# Altium schematic sheet ard_connector.SchDoc
size A
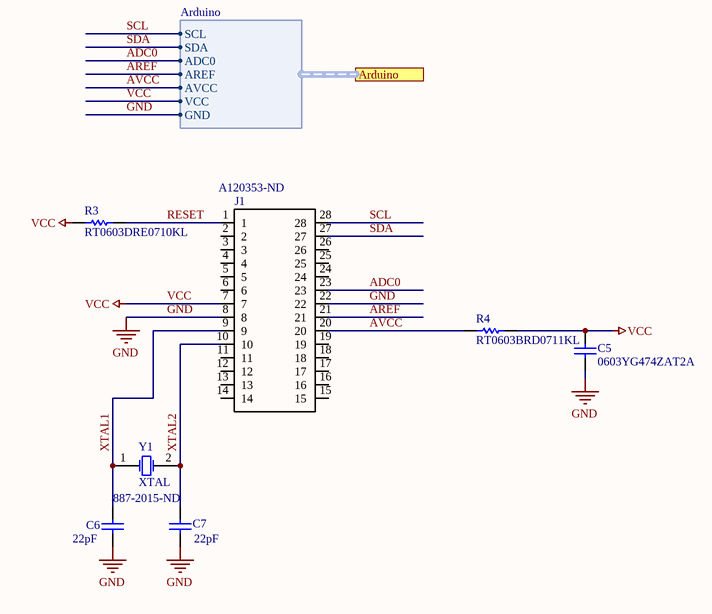
[diagram p0: ard_connector.SchDoc]

## Parts
C5  0603YG474ZAT2A  [CAPC1608X90X35ML15T15]
C6  Capacitance: 22pF  [CAPC1608X90X30LL10T20]  (hidden comment: CL10C220JB8NNNC)
C7  Capacitance: 22pF  [CAPC1608X90X30LL10T20]  (hidden comment: CL10C220JB8NNNC)
J1  Supplier Part Number 1: A120353-ND  [*DIP762W60P254L3556H510Q28]  (hidden comment: 1-2199298-9)
R3  RT0603DRE0710KL  [RESC1608X55X25ML10T15]
R4  RT0603BRD0711KL  [RESC1608X55X25LL10T15]
Y1  XTAL  Supplier Part Number 1: 887-2015-ND  [R38]

## Ports
Arduino (harness Arduino)

## Harnesses
Arduino: SCL, SDA, ADC0, AREF, AVCC, VCC, GND

## Nets
GND: C5.1 C6.1 C7.1 J1.8 J1.22 ; port Arduino.GND
VCC: C5.2 J1.7 R3.1 R4.2 ; port Arduino.VCC
ADC0: J1.23 ; port Arduino.ADC0
AREF: J1.21 ; port Arduino.AREF
AVCC: J1.20 R4.1 ; port Arduino.AVCC
RESET: J1.1 R3.2
SCL: J1.28 ; port Arduino.SCL
SDA: J1.27 ; port Arduino.SDA
XTAL1: C6.2 J1.9 Y1.1(OSC1)
XTAL2: C7.2 J1.10 Y1.2(OSC2)

Not connected (* = marked no-connect by the designer): J1 2 3 4 5 6 11 12 13 14 15 16 17 18 19 24 25 26

## Library data of the parts
C5 = CMP-2006-04546-1: Manufacturer: AVX Interconnect / Elco; Part Number: 0603YG474ZAT2A
C6 C7 = CMP-2000-06101-1: Chip Capacitor, 22 pF, +/- 5%, 50 V, -55 to 125 degC, 0603 (1608 Metric), RoHS, Tape and Reel; Manufacturer: Samsung Electro-Mechanics; Rated Voltage: 50V; Dielectric: C0G; Case Size/Dimension: 0603; Mounting Technology: SurfaceMount; Tolerance (%): ±5%; Package Description: 2-Pin Surface Mount Device, Body 1.60 x 0.80 mm; Manufacturer URL: http://www.samsungsem.com/global/index.jsp; Datasheet URL: http://www.samsungsem.com/kr/support/product-search/mlcc/__icsFiles/afieldfile/2016/08/18/S_CL10C220JB8NNNC.pdf; Datasheet Version: 06/2016; Package Reference: 0603
J1 = 1-2199298-9: CONN IC DIP SOCKET 28POS TIN; Number_of_Positions: 28; MF: TE Connectivity; Centerline_Pitch: 2.54 mm[.1 in]; Connector Type: Pin; Current Rating: 1A; Insulation Resistance: 1GR; Mating Alignment: Yes (With); Row Spacing: 0.3inch; Pitch: 2.54mm; Contact Post Length: 3inch; TE_purchase_URL: https://www.te.com/usa-en/product-1-2199298-9.html?te_bu=Cor&te_type=disp&te_campaign=seda_glo_cor-seda-global-disp-prtnr-fy19-seda-model-bom-cta_sma-317_1&elqCampaignId=32493; Product_Type: Socket; EU_RoHS_Compliance: Compliant; SnapEDA_Link: https://www.snapeda.com/parts/1-2199298-9/TE%20Connectivity%20AMP%20Connectors/view-part/1265789/?ref=snap; MP: 1-2199298-9; Digi-Key_Purchase_URL: https://www.digikey.com/product-detail/en/te-connectivity-amp-connectors/1-2199298-9/A120353-ND/5022045?utm_source=snapeda&utm_medium=aggregator&utm_campaign=symbol; Digi-Key_Part_Number: A120353-ND; Package: PDIP-28 TE Connectivity; Value: *; Supplier 1: Digi-Key; Manufacturer: TE Connectivity; Manufacturer Part Number: 1-2199298-9; RoHS: Yes; Category: IC and Component Sockets; Stock 1: 4877; Pricing 1: 1=0.73000, 10=0.68600, 25=0.61760, 50=0.54920, 100=0.52630, 250=0.48052, 500=0.45762, 1000=0.37754, 2500=0.34322 (USD); Mount: Through Hole; Contact Material: Bronze; Contact Plating: Tin; Color: Black; Insulation Material: Thermoplastic; Housing Material: PBT; Min Operating Temperature: -40°C; Max Operating Temperature: 105°C; Number of Rows: 2; Number of Contacts: 28; Termination: Through Hole; Number of Poles: 28; Orientation: Straight; Packaging: Rail/Tube; Number of Positions: 28; Package Quantity: 17; Contact Current Rating: 1A; Length: 1.4inch; Radiation Hardening: No; REACH SVHC: Unknown; ELV: Compliant; Flammability Rating: UL94 V-0; ComponentLink1URL: https://www.distrelec.biz/Web/Downloads/_t/ds/1-2199298-9_eng_tds.pdf?mime=application%2Fpdf&src-supplier=Distrelec; ComponentLink1Description: https://www.distrelec.biz/Web/Downloads/_t/ds/1-2199298-9_eng_tds.pdf?mime=application%2Fpdf&src-supplier=Distrelec; ComponentLink2URL: http://www.te.com/commerce/DocumentDelivery/DDEController?Action=showdoc&DocId=Customer+Drawing%7F2199298%7FA%7Fpdf%7FEnglish%7FENG_CD_2199298_A_baseFilename.pdf&src-supplier=Avnet; ComponentLink2Description: http://www.te.com/commerce/DocumentDelivery/DDEController?Action=showdoc&DocId=Customer+Drawing%7F2199298%7FA%7Fpdf%7FEnglish%7FENG_CD_2199298_A_baseFilename.pdf&src-supplier=Avnet; ComponentLink3URL: https://www.te.com/commerce/DocumentDelivery/DDEController?Action=srchrtrv&DocNm=2199298&DocType=Customer+Drawing&DocLang=English&src-supplier=Digi-Key; ComponentLink3Description: https://www.te.com/commerce/DocumentDelivery/DDEController?Action=srchrtrv&DocNm=2199298&DocType=Customer+Drawing&DocLang=English&src-supplier=Digi-Key
R3 = CMP-2000-04608-1: Manufacturer: Yageo; Part Number: RT0603DRE0710KL
R4 = CMP-2000-04350-1: Manufacturer: Yageo; Part Number: RT0603BRD0711KL
Y1 = XTAL: CRYSTAL 16.000MHZ 20PF THRU; Manufacturer: TXC; Manufacturer Part Number: 9B-16.000MBBK-B; Frequency: 16MHz; Frequency Tolerance: 50ppm; ESR (Equivalent Series Resistance): 30R; Published: 8-Jun-2000; LatestRevisionDate: 17-Jul-2002; LatestRevisionNote: Re-released for DXP Platform.; PackageReference: R38; Publisher: Altium Limited; PackageDescription: Crystal, Thru-Hole; 2 Leads; Body 3.1 x 8.2 mm (Dia.xH); Supplier 1: Digi-Key; RoHS: Yes; Category: Crystals; Stock 1: 2492; Pricing 1: 1=0.30000, 10=0.25000, 50=0.22500, 100=0.20000, 500=0.19000, 1000=0.16000, 2500=0.15000, 5000=0.14500, 10000=0.14000 (USD); Mount: Through Hole; Case/Package: Metal; Number of Pins: 2; Min Operating Temperature: -20°C; Max Operating Temperature: 70°C; Package Quantity: 1000; Packaging: Bulk; Load Capacitance: 20pF; Frequency Stability: 50ppm; Length: 0.453inch; Height: 0.145inch; Width: 0.197inch; Depth: 5mm; ComponentLink1URL: https://datasheet.ciiva.com/6733/9b-6733741.pdf?src-supplier=Digi-Key; ComponentLink1Description: https://datasheet.ciiva.com/6733/9b-6733741.pdf?src-supplier=Digi-Key